# EasyEDA Pro project Project.eprj

# Schematic Schematic
Create Date: 2023-04-05; Page Name: Final; Project Name: Project; Schematic Name: Schematic; Update Date: 2023-04-13; Version: V1.0
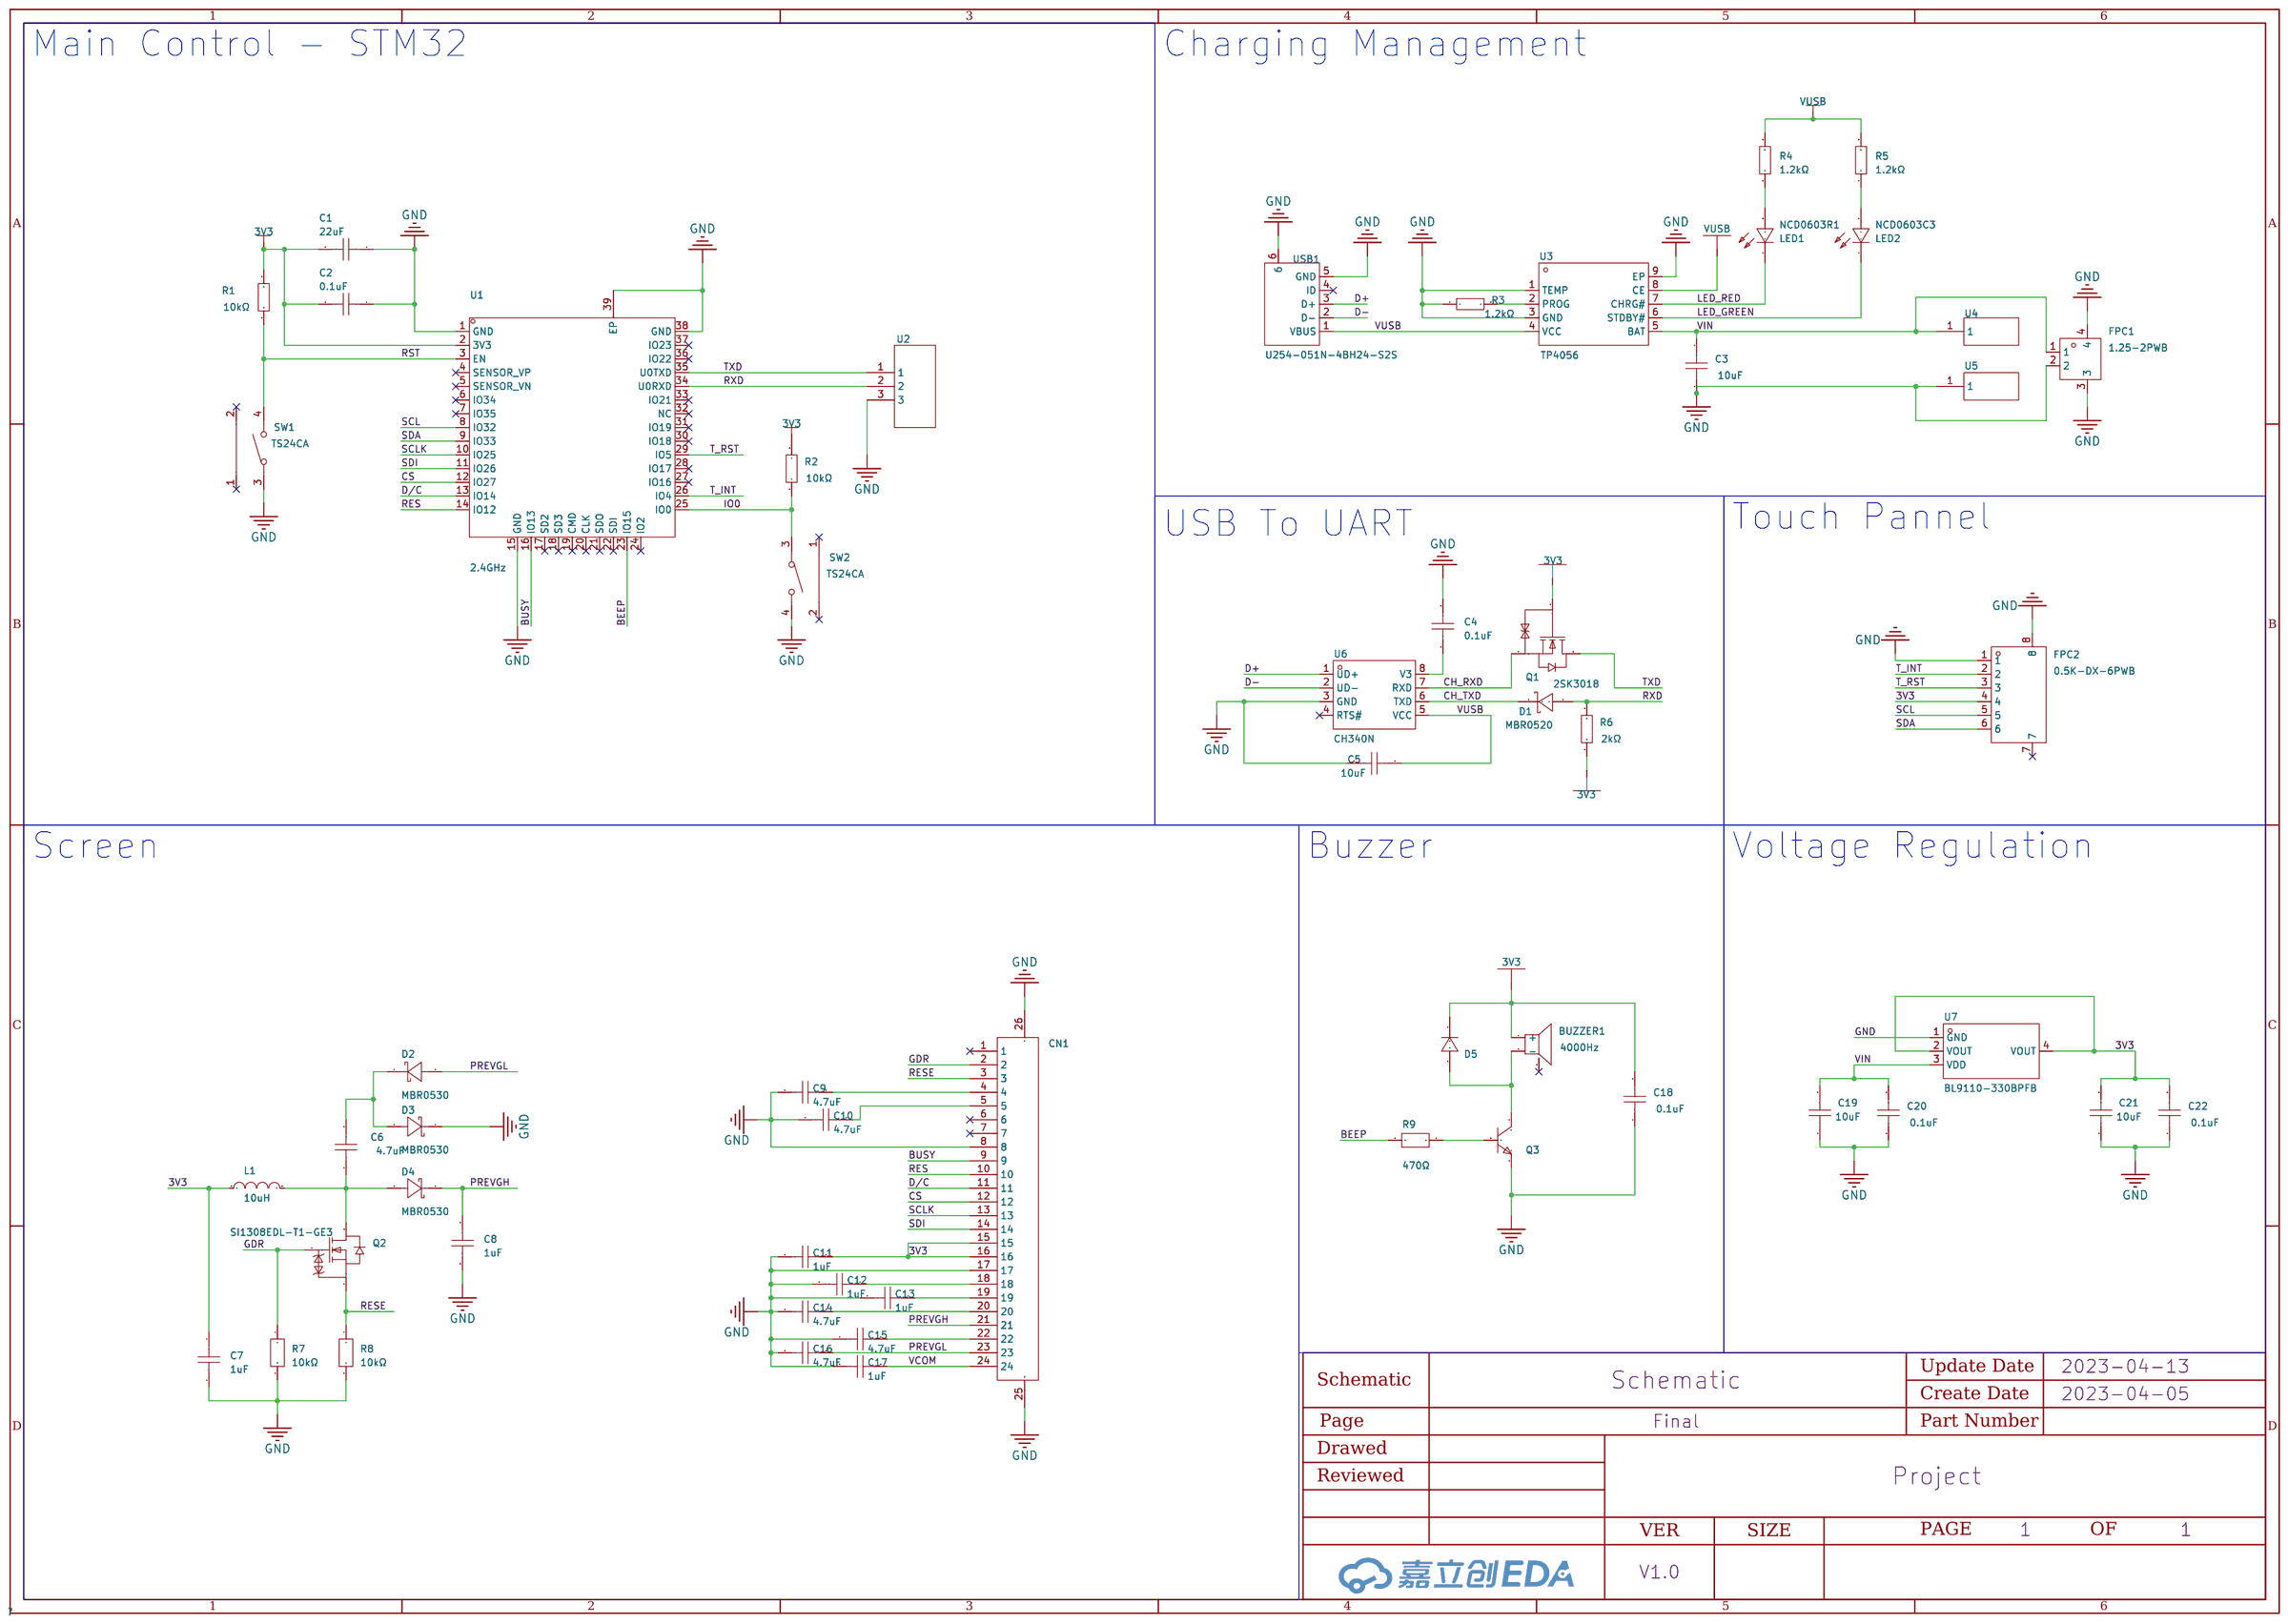
[diagram p0: schematic sheet]

## Parts
BUZZER1  4000Hz  [BUZ-SMD_L5.0-W5.5-P4.60]
C1  22uF  [c0603]
C2  0.1uF  [c0603]
C3  10uF  [C0603]
C4  0.1uF  [C0603]
C5  10uF  [c0603]
C6  4.7uF  [c0603]
C7  1uF  [c0603]
C8  1uF  [c0603]
C9  4.7uF  [C0603]
C10  4.7uF  [C0603]
C11  1uF  [c0603]
C12  1uF  [c0603]
C13  1uF  [c0603]
C14  4.7uF  [C0603]
C15  4.7uF  [C0603]
C16  4.7uF  [C0603]
C17  1uF  [c0603]
C18  0.1uF  [C0603]
C19  10uF  [c0603]
C20  0.1uF  [C0603]
C21  10uF  [c0603]
C22  0.1uF  [C0603]
CN1  0.5-24P翻盖  [FPC-SMD_24P-P0.50-L6.1-W16.4]
D1  MBR0520  [SOD-123_L2.8-W1.8-LS3.7-RD]
D2  MBR0530  [SOD-123_L2.7-W1.6-LS3.7-RD-1]
D3  MBR0530  [SOD-123_L2.7-W1.6-LS3.7-RD-1]
D4  MBR0530  [SOD-123_L2.7-W1.6-LS3.7-RD-1]
D5  IN4148WS  [SOD-323_L1.8-W1.3-LS2.5-RD]
FPC1  1.25-2PWB  [CONN-SMD_2P-P1.25_DEALON_1.25-2PWB]
FPC2  0.5K-DX-6PWB  [FPC-SMD_6P-P0.50_DEALON_0.5K-DX-6PWB]
L1  10uH  [ind-smd_l2.0-w1.6]
LED1  NCD0603R1  [LED0603-RD_RED]
LED2  NCD0603C3  [LED0603-RD]
Q1  2SK3018  [SOT-23-3_L2.9-W1.3-P1.90-LS2.4-BR]
Q2  SI1308EDL-T1-GE3  [SOT-323_L2.0-W1.3-P1.30-LS2.1-BR]
Q3  KST8050S  [SOT-23_L2.9-W1.3-P1.90-LS2.4-BR]
R1  10kΩ  [R0603]
R2  10kΩ  [R0603]
R3  1.2kΩ  [R0603]
R4  1.2kΩ  [R0603]
R5  1.2kΩ  [R0603]
R6  2kΩ  [R0603]
R7  10kΩ  [r0603]
R8  10kΩ  [r0603]
R9  470Ω  [r0603]
SW1  TS24CA  [SW-SMD_TS24CA]
SW2  TS24CA  [SW-SMD_TS24CA]
U1  2.4GHz  [WIRELM-SMD_ESP32-S]
U2  -  [下载调试点]
U3  TP4056  [ESOP-8_L4.9-W3.9-P1.27-LS6.0-BL-EP]
U4  -  [电池焊接端子封装2]
U5  -  [电池焊接端子封装2]
U6  CH340N  [SOP-8_L4.9-W3.9-P1.27-LS6.0-BL]
U7  BL9110-330BPFB  [SOT-223_L6.5-W3.5-P2.30-LS7.0-BR]
USB1  U254-051N-4BH24-S2S  [MICRO-USB-SMD_U254-051N-4BH24-S2]

## Library data of the parts
BUZZER1 = MLT-5020: 驱动方式:无源(外部驱动);构造类型:电磁式;频率:4000Hz;长度:5.2mm;宽度:5.2mm;高度:2.5mm;; Supplier Part: C94598; Manufacturer: 华能; Supplier Footprint: SMD,5x5mm; JLCPCB Part Class: Extended Part; Datasheet: https://atta.szlcsc.com/upload/public/pdf/source/20210811/111454390007D221D7259018FB170E62.pdf; Supplier: LCSC; Oscillator Circuit: 无源(外部驱动); Technology Type: 电磁式; Length: 5.2mm; Width: 5.2mm; Height: 2.5mm
C1 = mt18n1r5c500ct: 容值:22uF;精度:±0.25pF;额定电压:50V;温度系数:NP0;; LCSC Part Name: 22uF 25V; Supplier Part: C96446; Manufacturer: 华新科(Walsin); Manufacturer Part: MT18N1R5C500CT; Supplier Footprint: 0603; JLCPCB Part Class: Extended Part; Datasheet: https://atta.szlcsc.com/upload/public/pdf/source/20191217/C470045_C8EA1FED8E7D9FF06975A0CE3DEB0325.pdf; Supplier: LCSC; Tolerance: ±0.25pF; Voltage Rated: 50V; Temperature Coefficient: NP0
C2 = mt18n1r5c500ct: 容值：100nF 精度：±10% 额定电压：50V 材质(温度系数)：X7R 材质:X7R; LCSC Part Name: 100nF; Supplier Part: C14663; Manufacturer: 华新科(Walsin); Manufacturer Part: MT18N1R5C500CT; Supplier Footprint: 0603; JLCPCB Part Class: Extended Part; Datasheet: https://atta.szlcsc.com/upload/public/pdf/source/20191217/C470045_C8EA1FED8E7D9FF06975A0CE3DEB0325.pdf; Supplier: LCSC; Tolerance: ±0.25pF; Voltage Rated: 50V; Temperature Coefficient: NP0
C3 = JMK107BC6106MA-T: 容值:10uF;精度:±20%;额定电压:-;材质(温度系数):-;; LCSC Part Name: 10uF ±20%; Supplier Part: C669868; Manufacturer: TAIYO YUDEN(太诱); Supplier Footprint: 0603; JLCPCB Part Class: Extended Part; Datasheet: https://atta.szlcsc.com/upload/public/pdf/source/20200708/C669868_7EB6EA763537011BBD5B3495B56B624F.pdf; Supplier: LCSC; Tolerance: ±20%
C4 = CC0603KRX7R9BB104: 温度系数:X7R;容值:100nF;电容体长:-;精度:±10%;电容体宽:-;电容体厚度:-;额定电压:50V;; LCSC Part Name: 100nF ±10% 50V; Supplier Part: C14663; Manufacturer: YAGEO(国巨); Supplier Footprint: 0603; JLCPCB Part Class: Basic Part; Datasheet: https://atta.szlcsc.com/upload/public/pdf/source/20170116/1484561234239.pdf; Supplier: LCSC; Temperature Coefficient: X7R; Tolerance: ±10%; Voltage Rated: 50V
C5 = mt18n1r5c500ct: 容值:10uF;精度:±0.25pF;额定电压:50V;温度系数:NP0;; LCSC Part Name: 10uF 25V; Supplier Part: C96446; Manufacturer: 华新科(Walsin); Manufacturer Part: MT18N1R5C500CT; Supplier Footprint: 0603; JLCPCB Part Class: Extended Part; Datasheet: https://atta.szlcsc.com/upload/public/pdf/source/20191217/C470045_C8EA1FED8E7D9FF06975A0CE3DEB0325.pdf; Supplier: LCSC; Tolerance: ±0.25pF; Voltage Rated: 50V; Temperature Coefficient: NP0
C6 = mt18n1r5c500ct: 容值：4.7uF 精度：±10% 额定电压：35V 材质(温度系数)：X5R; LCSC Part Name: 4.7uF 35V; Supplier Part: C329940; Manufacturer: 华新科(Walsin); Manufacturer Part: MT18N1R5C500CT; Supplier Footprint: 0603; JLCPCB Part Class: Extended Part; Datasheet: https://atta.szlcsc.com/upload/public/pdf/source/20191217/C470045_C8EA1FED8E7D9FF06975A0CE3DEB0325.pdf; Supplier: LCSC; Tolerance: ±0.25pF; Voltage Rated: 50V; Temperature Coefficient: NP0
C7 C8 C11-C13 C17 = mt18n1r5c500ct: 容值：1uF 精度：±10% 额定电压：50V 材质(温度系数)：X5R 材质:X5R; LCSC Part Name: 1uF 50V; Supplier Part: C15849; Manufacturer: 华新科(Walsin); Manufacturer Part: MT18N1R5C500CT; Supplier Footprint: 0603; JLCPCB Part Class: Extended Part; Datasheet: https://atta.szlcsc.com/upload/public/pdf/source/20191217/C470045_C8EA1FED8E7D9FF06975A0CE3DEB0325.pdf; Supplier: LCSC; Tolerance: ±0.25pF; Voltage Rated: 50V; Temperature Coefficient: NP0
C9 C10 C14-C16 = C1608X5R1V475KT000E: 容值:4.7uF;精度:±10%;额定电压:35V;材质(温度系数):X5R;; LCSC Part Name: 4.7uF ±10% 35V; Supplier Part: C329940; Manufacturer: TDK; Supplier Footprint: 0603; JLCPCB Part Class: Extended Part; Datasheet: https://atta.szlcsc.com/upload/public/pdf/source/20190926/C329940_3676AC3B1F2ADAB27683D7ACF547C42E.pdf; Supplier: LCSC; Tolerance: ±10%; Voltage Rated: 35V; Temperature Coefficient: X5R
C18 C20 C22 = CL10B104KB8NNNC: 容值:100nF;精度:±10%;额定电压:50V;温度系数:X7R;; LCSC Part Name: 100nF ±10% 50V; Supplier Part: C1591; Manufacturer: SAMSUNG(三星); Supplier Footprint: 0603; JLCPCB Part Class: Extended Part; Datasheet: https://atta.szlcsc.com/upload/public/pdf/source/20160103/1457707680512.pdf; Supplier: LCSC; Tolerance: ±10%; Voltage Rated: 50V; Temperature Coefficient: X7R
C19 C21 = mt18n1r5c500ct: 容值:10uF;精度:±0.25pF;额定电压:50V;温度系数:NP0;; Supplier Part: C96446; Manufacturer: 华新科(Walsin); Manufacturer Part: MT18N1R5C500CT; Supplier Footprint: 0603; JLCPCB Part Class: Extended Part; Datasheet: https://atta.szlcsc.com/upload/public/pdf/source/20191217/C470045_C8EA1FED8E7D9FF06975A0CE3DEB0325.pdf; Supplier: LCSC; Tolerance: ±0.25pF; Voltage Rated: 50V; Temperature Coefficient: NP0
CN1 = 0.5-24P翻盖: 间距:0.5mm;触点数量:24;锁定特性:翻盖式;安装类型:卧贴;触点类型:下接;工作温度范围:-;; LCSC Part Name: 0.5mm P数:24 翻盖式 下接; Supplier Part: C20688; Manufacturer: BOOMELE(博穆精密); Supplier Footprint: SMD,P=0.5mm; JLCPCB Part Class: Extended Part; Datasheet: https://atta.szlcsc.com/upload/public/pdf/source/20151109/1457707553990.pdf; Supplier: LCSC; Pitch: 0.5mm; Number of Contacts: 24; Locking Feature: 翻盖式; Mounting Type: 卧贴; Contact Type: 下接; Height Above Board: 2mm; FFC, FCB Thickness: 0.3mm
D1 = MBR0520_C77335: 直流反向耐压(Vr):20V;平均整流电流(Io):500mA;正向压降(Vf):450mV 500mA;; Supplier Part: C77335; Manufacturer: CJ（江苏长电/长晶）; Supplier Footprint: SOD-123; JLCPCB Part Class: Extended Part; Datasheet: https://atta.szlcsc.com/upload/public/pdf/source/20160702/1467448303289.pdf; Supplier: LCSC; Reverse Voltage (Vr): 20V; Average Rectified Current (Io): 500mA; Forward Voltage (Vf@If): 450mV 500mA
D2-D4 = MBR0530_C699108: LCSC Part Name: 小信号肖特基二极管; Supplier Part: C699108; Manufacturer: YANGJIE(扬杰); Supplier Footprint: SOD-123; JLCPCB Part Class: Extended Part; Datasheet: https://atta.szlcsc.com/upload/public/pdf/source/20200709/C699108_94C8F1A54679DD603C9696C8694A3BC2.pdf; Supplier: LCSC
D5 = IN4148WS: 二极管配置:独立式;功率:200mW;直流反向耐压(Vr):100V;平均整流电流(Io):200mA;正向压降(Vf):1V@10mA;反向电流(Ir):5A@75V;反向恢复时间(trr):4ns;工作温度:+150@(Tj);; LCSC Part Name: 100V 200mA 4ns; Supplier Part: C417545; Manufacturer: LRC(乐山无线电); Supplier Footprint: SOD-323; JLCPCB Part Class: 扩展库; Datasheet: https://atta.szlcsc.com/upload/public/pdf/source/20190911/C417545_CB999573A39316D3E44B0FF1B4B78E30.pdf; Supplier: LCSC; Diode Configuration: 独立式; Power Dissipation: 200mW; Reverse Voltage (Vr): 100V; Average Rectified Current (Io): 200mA; Forward Voltage (Vf@If): 1V@10mA; Reverse Leakage Current: 5A@75V; Reverse Recovery Time (trr): 4ns; Operating Temperature: +150@(Tj)
FPC1 = 1.25-2PWB: 参考系列:-;间距:1.25mm;插针结构:1x2P;排数:1;每排PIN数:2;行距:-;公母:公型插针;安装方式:卧贴;额定电流:-;工作温度范围:-40~+85;; LCSC Part Name: 1.25mm 1x2P 卧贴; Supplier Part: C2905009; Manufacturer: DEALON(德艺隆); Supplier Footprint: SMD,P=1.25mm; JLCPCB Part Class: 扩展库; Datasheet: https://atta.szlcsc.com/upload/public/pdf/source/20211025/32B11FCE5054D08D2841E43E3DE676AA.pdf; Supplier: LCSC; Pitch: 1.25mm; Pins Structure: 1x2P; Number of Rows: 1; Number of PINs Per Row: 2; Gender: 公型插针; Mounting Style: 卧贴; Operating Temperature Range: -40~+85
FPC2 = 0.5K-DX-6PWB: 间距:0.5mm;触点数量:6;锁定特性:翻盖式;安装类型:卧贴;触点类型:下接;工作温度范围:-20℃~+85℃;; LCSC Part Name: 0.5mm P数:6 翻盖式 下接; Supplier Part: C2911832; Manufacturer: HDGC(华德共创); Supplier Footprint: SMD,P=0.5mm; JLCPCB Part Class: Extended Part; Datasheet: https://atta.szlcsc.com/upload/public/pdf/source/20211029/5210AEC837E1AC9B697C39805C1E664F.pdf; Supplier: LCSC; Pitch: 0.5mm; Number of Contacts: 6; Locking Feature: 翻盖式; Mounting Type: 卧贴; Contact Type: 下接; Height Above Board: 2mm; FFC, FCB Thickness: 0.3mm; Operating Temperature Range: -20℃~+85℃
L1 = wpn201610h100mt: 电感值:10uH;精度:±20%;额定电流:650mA;直流电阻(DCR):826mΩ;; LCSC Part Name: 10uH ±20% 650mA 826mΩ; Supplier Part: C89132; Manufacturer: Sunlord(顺络); Manufacturer Part: WPN201610H100MT; Supplier Footprint: SMD; JLCPCB Part Class: Extended Part; Datasheet: https://atta.szlcsc.com/upload/public/pdf/source/20210916/5D33DED32780FEB7D0AA8BED8FC93477.pdf; Supplier: LCSC; Tolerance: ±20%; Rated Current: 650mA; DC Resistance (DCR): 826mΩ
LED1 = NCD0603R1_C84263: 发光颜色:红灯;; LCSC Part Name: 红灯; Supplier Part: C84263; Manufacturer: 国星光电; Supplier Footprint: 0603; JLCPCB Part Class: Extended Part; Datasheet: https://atta.szlcsc.com/upload/public/pdf/source/20200820/C84263_DABC6A75E58F576973B407FDBA283D60.pdf; Supplier: LCSC; Emitted Color: 红灯
LED2 = NCD0603C3: 发光颜色:普绿/黄绿;; LCSC Part Name: 普绿/黄绿; Supplier Part: C89809; Manufacturer: 国星光电; Supplier Footprint: 0603; JLCPCB Part Class: Extended Part; Datasheet: https://atta.szlcsc.com/upload/public/pdf/source/20200820/C89809_21AF9C24539E838255C9E61C110C9630.pdf; Supplier: LCSC; Emitted Color: 普绿/黄绿
Q1 = 2SK3018_C8562: 阈值电压(Vgs(th)@Id):1.5V 100A;功率(Pd):350mW;导通电阻(RDS(on)@Vgs,Id):8Ω 10mA,4V;漏源电压(Vdss):30V;类型:N沟道;连续漏极电流(Id):100mA;; Supplier Part: C8562; Manufacturer: CJ（江苏长电/长晶）; Supplier Footprint: SOT-23(SOT-23-3); JLCPCB Part Class: Extended Part; Datasheet: https://atta.szlcsc.com/upload/public/pdf/source/20140809/1457707215233.pdf; Supplier: LCSC; Gate Threshold Voltage (Vgs(th)@Id): 1.5V 100A; Power Dissipation (Pd): 350mW; Drain Source On Resistance (RDS(on)@Vgs,Id): 8Ω 10mA,4V; Drain Source Voltage (Vdss): 30V; Type: N沟道; Continuous Drain Current (Id): 100mA
Q2 = SI1308EDL-T1-GE3: 连续漏极电流(Id):1.4A;漏源电压(Vdss):30V;类型:N沟道;阈值电压(Vgs(th)@Id):1.5V 250A;导通电阻(RDS(on)@Vgs,Id):132mΩ 1.4A,10V;功率(Pd):400mW;; Supplier Part: C469327; Manufacturer: VISHAY(威世); Supplier Footprint: SOT-323; JLCPCB Part Class: Extended Part; Datasheet: https://atta.szlcsc.com/upload/public/pdf/source/20191217/C469327_3FE8BCBB7604A1B1F6779A1D9DD725BB.pdf; Supplier: LCSC; Continuous Drain Current (Id): 1.4A; Drain Source Voltage (Vdss): 30V; Type: N沟道; Gate Threshold Voltage (Vgs(th)@Id): 1.5V 250A; Drain Source On Resistance (RDS(on)@Vgs,Id): 132mΩ 1.4A,10V; Power Dissipation (Pd): 400mW
Q3 = KST8050S: 晶体管类型:NPN;集射极击穿电压(Vceo):25V;集电极电流(Ic):500mA;功率(Pd):300mW;; Supplier Part: C369924; Manufacturer: KEXIN(科信); Supplier Footprint: SOT-23; JLCPCB Part Class: 扩展库; Datasheet: https://atta.szlcsc.com/upload/public/pdf/source/20190320/C369924_F8D3618043520638745BFFFB8460FA42.pdf; Supplier: LCSC; Transistor Type: NPN; Collector-Emitter Breakdown Voltage (Vceo): 25V; Collector Current (Ic): 500mA; Power Dissipation (Pd): 300mW
R1 R2 = ERJPB3B1002V: 电阻类型:厚膜电阻;阻值:10kΩ;精度:±0.1%;功率:200mW;温度系数:±50ppm/℃;最大工作电压:200V;工作温度范围:-55℃~+155℃;; LCSC Part Name: 10kΩ ±0.1% 200mW; Supplier Part: C161787; Manufacturer: PANASONIC(松下); Supplier Footprint: 0603; Datasheet: https://atta.szlcsc.com/upload/public/pdf/source/20180125/C161787_15168649453061302830.pdf; Supplier: LCSC; Type: 厚膜电阻; Tolerance: ±0.1%; Power(Watts): 200mW; Temperature Coefficient: ±50ppm/℃; Overload Voltage (Max): 200V; Operating Temperature Range: -55℃~+155℃
R3-R5 = MCR03EZPJ122: 电阻类型:厚膜电阻;阻值:1.2kΩ;精度:±5%;功率:100mW;温度系数:±200ppm/℃;最大工作电压:50V;工作温度范围:-55℃~+155℃;; LCSC Part Name: 1.2kΩ ±5% 100mW; Supplier Part: C162003; Manufacturer: ROHM(罗姆); Supplier Footprint: 0603; JLCPCB Part Class: Extended Part; Datasheet: https://atta.szlcsc.com/upload/public/pdf/source/20180719/C162003_059215F5F2DABBD5624ED248BA884FE5.pdf; Supplier: LCSC; Type: 厚膜电阻; Tolerance: ±5%; Power(Watts): 100mW; Temperature Coefficient: ±200ppm/℃; Overload Voltage (Max): 50V; Operating Temperature Range: -55℃~+155℃
R6 = 0603WAF2001T5E: 精度:±1%;阻值:2kΩ;温度系数:±100ppm/℃;功率:1/10W;最大工作电压:75V;工作温度范围:-55℃~+155℃;; LCSC Part Name: 2KΩ ±1%; Supplier Part: C22975; Manufacturer: UNI-ROYAL(厚声); Supplier Footprint: 0603; JLCPCB Part Class: Basic Part; Datasheet: https://atta.szlcsc.com/upload/public/pdf/source/20170920/C22975_1505901012894982362.pdf; Supplier: LCSC; Tolerance: ±1%; Temperature Coefficient: ±100ppm/℃; Power(Watts): 1/10W; Overload Voltage (Max): 75V; Operating Temperature Range: -55℃~+155℃
R7 R8 = sg73p1jttd1002f: 阻值:10kΩ;精度:±1%;功率:-;温度系数:-;; LCSC Part Name: 10kΩ ±1%; Supplier Part: C880254; Manufacturer: KOA; Manufacturer Part: SG73P1JTTD1002F; Supplier Footprint: 0603; JLCPCB Part Class: Extended Part; Datasheet: https://atta.szlcsc.com/upload/public/pdf/source/20190109/C346159_A2BB9C83E7E727C8F8277542505B206B.pdf; Supplier: LCSC; Tolerance: ±1%
R9 = sg73p1jttd1002f: 阻值:470Ω;精度:±1%;功率:-;温度系数:-;; LCSC Part Name: 470kΩ ±1%; Supplier Part: C23179; Manufacturer: KOA; Manufacturer Part: SG73P1JTTD1002F; Supplier Footprint: 0603; JLCPCB Part Class: Extended Part; Datasheet: https://atta.szlcsc.com/upload/public/pdf/source/20190109/C346159_A2BB9C83E7E727C8F8277542505B206B.pdf; Supplier: LCSC; Tolerance: ±1%
SW1 SW2 = TS24CA: 触点电流:50mA;额定电压(DC):12V;电路结构:单刀单掷;安装方式:卧贴;按钮形状:矩形按钮;带灯:-;开关长度:4.55mm;开关宽度:1.8mm;开关高度:3.5mm;; LCSC Part Name: 2*4*3.5半包小贝贝TS-018小侧按键m165蓝牙耳机轻触开关; Supplier Part: C393942; Manufacturer: SHOU HAN(首韩); Supplier Footprint: SMD; JLCPCB Part Class: Extended Part; Datasheet: https://atta.szlcsc.com/upload/public/pdf/source/20190521/C393942_591A9E318887EFA4274D34029981AD99.pdf; Supplier: LCSC; Contact Current: 50mA; Voltage Rating (DC): 12V; Circuit: 单刀单掷; Mounting Style: 卧贴; Actuator Style: 矩形按钮; Switch Length: 4.55mm; Switch Width: 1.8mm; Switch Height: 3.5mm
U1 = ESP32-S: 频率:2.4GHz;发射功率:17dBm;核心处理器:LX6;天线形式:板载 PCB 天线/外接 IPEX;接收灵敏度:-90dBm;; Supplier Part: C277944; Manufacturer: Ai-Thinker(安信可); Supplier Footprint: SMD; JLCPCB Part Class: Extended Part; Datasheet: https://atta.szlcsc.com/upload/public/pdf/source/20211217/F4BEA33E732D6002D10DAED85BBCB52B.pdf; Supplier: LCSC; Output Power: 17dBm; Core Processor: LX6; Support Interface: I2C；UART；DAC；SPI；PWM；ADC; Antenna Type: 板载 PCB 天线/外接 IPEX; Wireless Standard: 802.11b/g/n; Operating Voltage: 3.3V; Sensitivity: -90dBm; Operating Temperature: -40℃~+85℃
U2 = 下载调试点
U3 = TP4056_C382139: LCSC Part Name: 1A锂电池充电IC; Supplier Part: C382139; Manufacturer: TPOWER(天源); Supplier Footprint: ESOP-8; JLCPCB Part Class: Extended Part; Datasheet: https://atta.szlcsc.com/upload/public/pdf/source/20190327/C382139_EC85960E6FE3E26856C240C81751A184.pdf; Supplier: LCSC
U4 U5 = 电池焊接端子2
U6 = CH340N: Supplier Part: C2977777; Manufacturer: WCH(南京沁恒); Supplier Footprint: SOP-8; JLCPCB Part Class: Extended Part; Datasheet: https://atta.szlcsc.com/upload/public/pdf/source/20220223/82A45E4FF89B3EDCAD50B354450A7EF4.pdf; Supplier: LCSC
U7 = BL9110-330BPFB: 输出类型:固定;输出极性:正;输出通道数:1;最大输入电压:6V;输出电压:3.3V;压差:390mV@(1A);输出电流:1A;电源纹波抑制比(PRSS):70dB@(1kHz);; LCSC Part Name: Vin=6V Vout=3.3V 1A 70dB@(1kHz); Supplier Part: C169246; Manufacturer: BL(上海贝岭); Supplier Footprint: SOT-223; JLCPCB Part Class: 扩展库; Datasheet: https://atta.szlcsc.com/upload/public/pdf/source/20180104/C169246_15150688220401230505.pdf; Supplier: LCSC; Output Type: 固定; Output Polarity: 正; Number of Outputs: 1; Maximum Input Voltage: 6V; Output Voltage: 3.3V; Dropout Voltage: 390mV@(1A); Output Current: 1A; Power Supply Rejection Ratio (PRSS): 70dB@(1kHz)
USB1 = U254-051N-4BH24-S2S: 连接器类型:Micro-B;标准:USB 2.0;公母:母座;触点数量:5;端口数量:1;安装方式:卧贴;额定电流 - 电源:1.8A;触头材质:铜合金;触头镀层:金;工作温度范围:-40℃~+85℃;焊接温度(最大值):260℃;; LCSC Part Name: Micro-B 母座 卧贴; Supplier Part: C692421; Manufacturer: XKB Connectivity(中国星坤); Supplier Footprint: SMD; JLCPCB Part Class: Extended Part; Datasheet: https://atta.szlcsc.com/upload/public/pdf/source/20211011/B206D16459F712703796869A87C6FBF1.pdf; Supplier: LCSC; Connector Type: Micro-B; Standard: USB 2.0; Gender: 母座; Number of Contacts: 5; Number of Ports: 1; Mounting Style: 卧贴; Current Rating - Power (Max): 1.8A; Contact Material: 铜合金; Contact Plating: 金; Operating Temperature Range: -40℃~+85℃; Welding Temperature (Max): 260℃

## Nets
3V3: BUZZER1.1(+) C1.2 C2.2 C7.1 C11.1 C18.2 C21.2 C22.2 CN1.15 CN1.16 D5.1(C) FPC2.4 L1.1 Q1.1(G) R1.2 R2.2 R6.1 U1.2(3V3) U7.2(VOUT) U7.4(VOUT)
GND: C1.1 C2.1 C3.1 C4.2 C5.2 C7.2 C8.2 C9.1 C10.1 C11.2 C12.2 C13.2 C14.1 C15.1 C16.1 C17.2 C18.1 C19.1 C20.1 C21.1 C22.1 CN1.8 CN1.17 CN1.25 CN1.26 D3.1(K) FPC1.2 FPC1.3 FPC1.4 FPC2.1 FPC2.8 Q3.2(E) R3.1 R7.2 R8.2 SW1.3 SW2.4 U1.1(GND) U1.15(GND) U1.38(GND) U1.39(EP) U2.3 U3.1(TEMP) U3.3(GND) U3.9(EP) U5.1 U6.3(GND) U7.1(GND) USB1.5(GND) USB1.6
VIN: C3.2 C19.2 C20.2 FPC1.1 U3.5(BAT) U4.1 U7.3(VDD)
BEEP: R9.1 U1.23(IO15)
BUSY: CN1.9 U1.16(IO13)
CH_RXD: Q1.2(S) U6.7(RXD)
CH_TXD: D1.1(K) U6.6(TXD)
CS: CN1.12 U1.12(IO27)
D+: U6.1(UD+) USB1.3(D+)
D-: U6.2(UD-) USB1.2(D-)
D/C: CN1.11 U1.13(IO14)
GDR: CN1.2 Q2.1(G) R7.1
IO0: R2.1 SW2.3 U1.25(IO0)
LED_GREEN: LED2.1(K) U3.6(STDBY#)
LED_RED: LED1.1(K) U3.7(CHRG#)
PREVGH: C8.1 CN1.21 D4.1(K)
PREVGL: C16.2 CN1.23 D2.2(A)
RES: CN1.10 U1.14(IO12)
RESE: CN1.3 Q2.2(S) R8.1
RST: R1.1 SW1.4 U1.3(EN)
RXD: D1.2(A) R6.2 U1.34(U0RXD) U2.2
SCL: FPC2.5 U1.8(IO32)
SCLK: CN1.13 U1.10(IO25)
SDA: FPC2.6 U1.9(IO33)
SDI: CN1.14 U1.11(IO26)
T_INT: FPC2.2 U1.26(IO4)
T_RST: FPC2.3 U1.29(IO5)
TXD: Q1.3(D) U1.35(U0TXD) U2.1
VCOM: C17.1 CN1.24
VUSB: C5.1 R4.2 R5.2 U3.4(VCC) U3.8(CE) U6.5(VCC) USB1.1(VBUS)
$15N651: LED2.2(A) R5.1
$15N655: R3.2 U3.2(PROG)
$15N663: LED1.2(A) R4.1
$15N3080: C4.1 U6.8(V3)
$15N5648: C6.1 D4.2(A) L1.2 Q2.3(D)
$15N5649: C6.2 D2.1(K) D3.2(A)
$15N5898: BUZZER1.2(-) D5.2(A) Q3.3(C)
$15N5899: Q3.1(B) R9.2
Net-(C9-2): C9.2 CN1.4
Net-(C10-2): C10.2 CN1.5
Net-(C12-1): C12.1 CN1.18
Net-(C13-1): C13.1 CN1.19
Net-(C14-2): C14.2 CN1.20
Net-(C15-2): C15.2 CN1.22

Not connected (* = marked no-connect by the designer): BUZZER1 3(NC)*; CN1 1* 6* 7*; FPC2 7*; SW1 1* 2*; SW2 1* 2*; U1 4(SENSOR_VP)* 5(SENSOR_VN)* 6(IO34)* 7(IO35)* 17(SD2)* 18(SD3)* 19(CMD)* 20(CLK)* 21(SDO)* 22(SDI)* 24(IO2)* 27(IO16)* 28(IO17)* 30(IO18)* 31(IO19)* 32(NC)* 33(IO21)* 36(IO22)* 37(IO23)*; U6 4(RTS#)*; USB1 4(ID)*

## Notes on the sheet
- Main Control - STM32
- Charging Management
- Touch Pannel
- USB To UART
- Screen
- Buzzer
- Voltage Regulation

# Board PCB
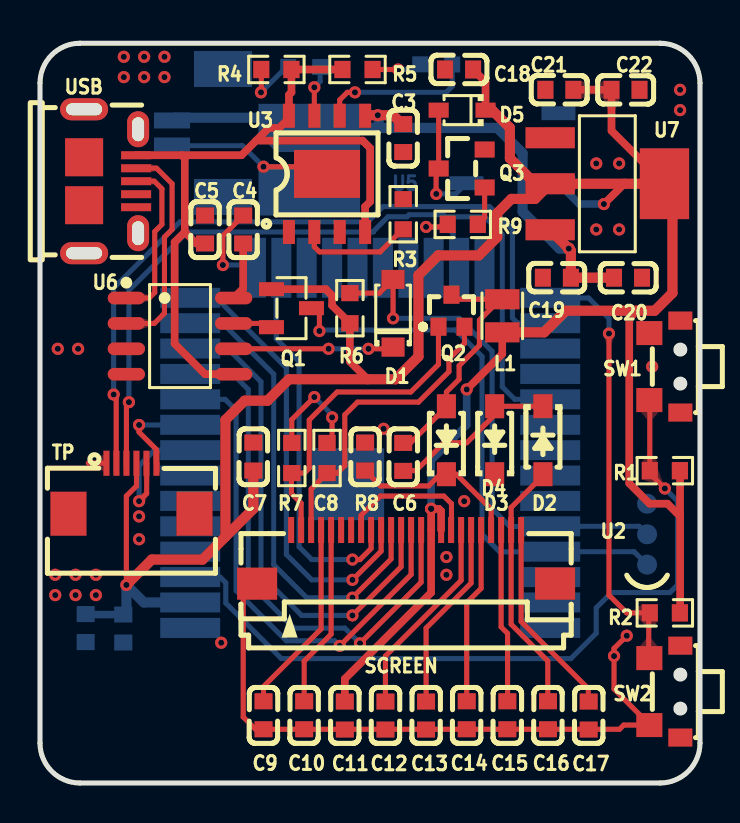
[diagram p1: board, top side]
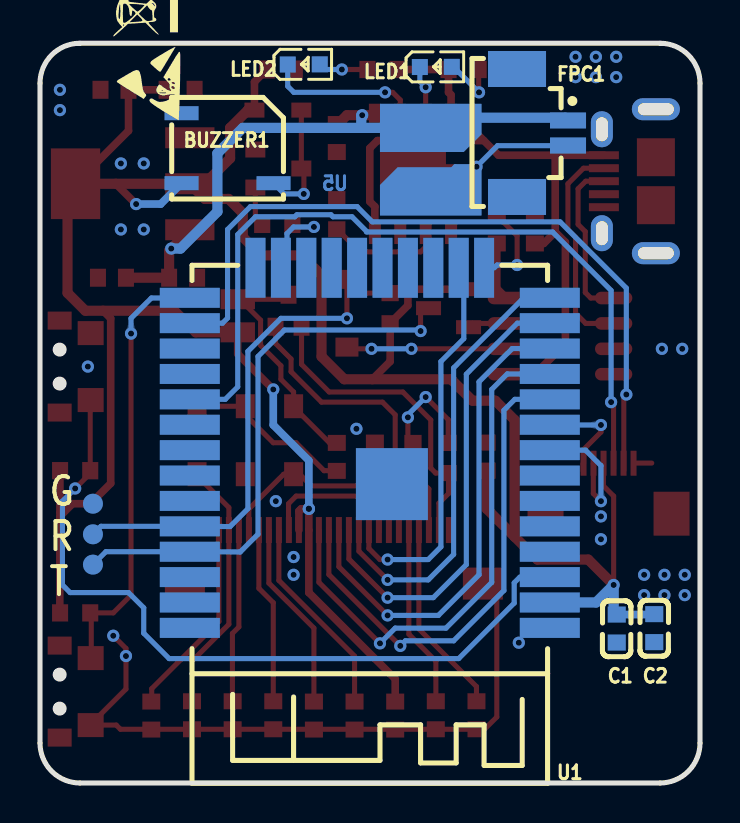
[diagram p2: board, bottom side, seen from below]

Outline 33 x 37 mm; copper layers: Top Layer, Bottom Layer. Coordinates in mm from the lower left corner of the outline.
Outline path: 0,35 0,2 arc(0.59,0.59) 2,0 31,0 arc(32.41,0.59) 33,2 33,35 arc(32.41,36.41) 31,37 2,37 arc(0.59,36.41) 0,35
Stack: Top Layer 0.035mm / Dielectric1 1.51mm FR4 er 4.5 / Bottom Layer 0.035mm

## Design rules (mm)
spacing safeClearance (default): track to track 0.152, other pairs 0.152 to 0.3
track width trackWidth (default): min 0.127, default 0.254, max 2.54
differential pair differentialPair (default): width min 0.127, default 0.254, max 2.54; gap min 0.152, default 0.152
via viaSize (default): diameter min 0.5, default 0.61, max 10; hole min 0.3, default 0.305, max 6

## Placement (name value [footprint] x y rotation side)
BUZZER1  4000Hz  [BUZ-SMD_L5.0-W5.5-P4.60]  23.62 31.75 180 bottom
C1  22uF  [c0603]  4.16 7.73 90 bottom
C2  0.1uF  [c0603]  2.29 7.75 90 bottom
C3  10uF  [C0603]  18.16 32.26 90 top
C4  0.1uF  [C0603]  10.16 27.69 90 top
C5  10uF  [c0603]  8.25 27.69 90 top
C6  4.7uF  [c0603]  18.16 16.31 270 top
C7  1uF  [c0603]  10.67 16.33 90 top
C8  1uF  [c0603]  16.26 16.33 90 top
C9  4.7uF  [C0603]  11.18 3.39 90 top
C10  4.7uF  [C0603]  13.21 3.39 90 top
C11  1uF  [c0603]  15.24 3.37 270 top
C12  1uF  [c0603]  17.27 3.37 270 top
C13  1uF  [c0603]  19.3 3.37 270 top
C14  4.7uF  [C0603]  21.34 3.39 90 top
C15  4.7uF  [C0603]  23.37 3.39 90 top
C16  4.7uF  [C0603]  25.4 3.39 90 top
C17  1uF  [c0603]  27.43 3.37 270 top
C18  0.1uF  [C0603]  20.96 35.69 0 top
C19  10uF  [c0603]  25.84 25.27 0 top
C20  0.1uF  [C0603]  29.4 25.27 180 top
C21  10uF  [c0603]  25.97 34.67 0 top
C22  0.1uF  [C0603]  29.28 34.67 180 top
D1  MBR0520  [SOD-123_L2.8-W1.8-LS3.7-RD]  17.65 23.5 90 top
D2  MBR0530  [SOD-123_L2.7-W1.6-LS3.7-RD-1]  25.15 17.14 270 top
D3  MBR0530  [SOD-123_L2.7-W1.6-LS3.7-RD-1]  22.73 17.14 90 top
D4  MBR0530  [SOD-123_L2.7-W1.6-LS3.7-RD-1]  20.32 17.14 90 top
D5  IN4148WS  [SOD-323_L1.8-W1.3-LS2.5-RD]  21.1 33.66 180 top
FPC1  1.25-2PWB  [CONN-SMD_2P-P1.25_DEALON_1.25-2PWB]  7.87 32.51 270 bottom
L1  10uH  [ind-smd_l2.0-w1.6]  23.11 23.37 270 top
LED1  NCD0603R1  [LED0603-RD_RED]  13.21 35.81 180 bottom
LED2  NCD0603C3  [LED0603-RD]  19.81 35.94 180 bottom
Q1  2SK3018  [SOT-23-3_L2.9-W1.3-P1.90-LS2.4-BR]  12.57 23.75 180 top
Q2  SI1308EDL-T1-GE3  [SOT-323_L2.0-W1.3-P1.30-LS2.1-BR]  20.57 23.62 270 top
Q3  KST8050S  [SOT-23_L2.9-W1.3-P1.90-LS2.4-BR]  21.08 30.73 0 top
R1  10kΩ  [R0603]  31.24 15.62 0 top
R2  10kΩ  [R0603]  31.24 8.51 0 top
R3  1.2kΩ  [R0603]  18.16 28.45 270 top
R4  1.2kΩ  [R0603]  11.82 35.69 0 top
R5  1.2kΩ  [R0603]  15.88 35.69 180 top
R6  2kΩ  [R0603]  15.49 23.75 90 top
R7  10kΩ  [r0603]  12.59 16.26 90 top
R8  10kΩ  [r0603]  14.35 16.26 90 top
R9  470Ω  [r0603]  21.14 27.94 0 top
SCREEN  0.5-24P翻盖  [FPC-SMD_24P-P0.50-L6.1-W16.4]  18.31 11.31 0 top
SW1  TS24CA  [SW-SMD_TS24CA]  31.24 20.83 270 top
SW2  TS24CA  [SW-SMD_TS24CA]  31.24 4.57 270 top
TP  0.5K-DX-6PWB  [FPC-SMD_6P-P0.50_DEALON_0.5K-DX-6PWB]  4.57 14.73 0 top
U1  2.4GHz  [WIRELM-SMD_ESP32-S]  16.51 16.76 0 bottom
U2  -  [下载调试点]  30.35 11.43 180 top
U3  TP4056  [ESOP-8_L4.9-W3.9-P1.27-LS6.0-BL-EP]  14.35 30.47 0 top
U4  -  [电池焊接端子封装2]  10.92 30.29 0 top
U5  -  [电池焊接端子封装2]  16 32.07 180 top
U6  CH340N  [SOP-8_L4.9-W3.9-P1.27-LS6.0-BL]  7 22.35 270 top
U7  BL9110-330BPFB  [SOT-223_L6.5-W3.5-P2.30-LS7.0-BR]  28.37 29.97 180 top
USB  U254-051N-4BH24-S2S  [MICRO-USB-SMD_U254-051N-4BH24-S2]  3.56 30.1 270 top

## Footprints (pads in the part's own frame, mm; a bottom-side part is the same pattern mirrored in y, then rotated)
BUZ-SMD_L5.0-W5.5-P4.60
  rect 1.7x0.7 smd: 1(-2.3,-1.75) 2(2.3,-1.75) 3(-2.3,1.75)
c0603
  rect 0.8x0.9 smd: 1(-0.7,0) 2(0.7,0)
C0603
  rect 0.8x0.9 smd: 1(-0.7,0) 2(0.7,0)
CONN-SMD_2P-P1.25_DEALON_1.25-2PWB
  rect 0.8x1.801 smd: 1(-0.625,1.275) 2(0.625,1.275)
  rect 1.801x2.901 smd: 3(-3.2,-1.275) 4(3.2,-1.275)
ESOP-8_L4.9-W3.9-P1.27-LS6.0-BL-EP
  rect 0.6x1.2 smd: 1(-1.905,-2.909) 2(-0.635,-2.909) 3(0.635,-2.909) 4(1.905,-2.909) 5(1.905,2.909) 6(0.635,2.909) 7(-0.635,2.909) 8(-1.905,2.909)
  rect 3.3x2.4 smd: 9(0,0)
FPC-SMD_6P-P0.50_DEALON_0.5K-DX-6PWB
  rect 0.3x1.25 smd: 1(-1.25,1.262) 2(-0.75,1.262) 3(-0.25,1.262) 4(0.25,1.262) 5(0.75,1.262) 6(1.25,1.262)
  rect 1.8x2.2 smd: 7(3.15,-1.262) 8(-3.15,-1.262)
FPC-SMD_24P-P0.50-L6.1-W16.4
  rect 0.3x1.3 smd: 1(-5.75,1.34) 2(-5.25,1.34) 3(-4.75,1.34) 4(-4.25,1.34) 5(-3.75,1.34) 6(-3.25,1.34) 7(-2.75,1.34) 8(-2.25,1.34) 9(-1.75,1.34) 10(-1.25,1.34) 11(-0.75,1.34) 12(-0.25,1.34) 13(0.25,1.34) 14(0.75,1.34) 15(1.25,1.34) 16(1.75,1.34) 17(2.25,1.34) 18(2.75,1.34) 19(3.25,1.34) 20(3.75,1.34) 21(4.25,1.34) 22(4.75,1.34) 23(5.25,1.34) 24(5.75,1.34)
  rect 2x1.6 smd: 25(7.449,-1.34) 26(-7.449,-1.34)
ind-smd_l2.0-w1.6
  rect 1x1.72 smd: 1(0.828,0) 2(-0.828,0)
LED0603-RD
  rect 0.8x0.8 smd: 1(-0.799,-0.004) 2(0.799,0.004)
LED0603-RD_RED
  rect 0.8x0.8 smd: 1(-0.799,-0.004) 2(0.799,0.004)
MICRO-USB-SMD_U254-051N-4BH24-S2
  rect 0.4x1.5 smd: 1(-1.3,1.25) 2(-0.65,1.25) 3(0,1.25) 4(0.65,1.25) 5(1.3,1.25)
  oval 1.1x2.4 hole 0.6x1.8: 6(-3.6,-1.35) 6(3.6,-1.35)
  oval 1.8x1.1 hole 1.2x0.6: 6(-2.6,1.35) 6(2.6,1.35)
  rect 1.9x1.9 smd: 6(-1.2,-1.35) 6(1.2,-1.35)
R0603
  rect 0.806x0.864 smd: 1(-0.753,0) 2(0.753,0)
r0603
  rect 0.806x0.864 smd: 1(-0.753,0) 2(0.753,0)
SOD-123_L2.7-W1.6-LS3.7-RD-1
  rect 1.2x0.95 smd: 1(-1.7,0) 2(1.7,0)
SOD-123_L2.8-W1.8-LS3.7-RD
  rect 0.95x1.15 smd: 1(-1.692,0) 2(1.692,0)
SOD-323_L1.8-W1.3-LS2.5-RD
  rect 1x0.75 smd: 1(-1.173,0) 2(1.173,0)
SOP-8_L4.9-W3.9-P1.27-LS6.0-BL
  oval 0.63x1.865 smd: 1(-1.905,-2.683) 2(-0.635,-2.683) 3(0.635,-2.683) 4(1.905,-2.683) 5(1.905,2.683) 6(0.635,2.683) 7(-0.635,2.683) 8(-1.905,2.683)
SOT-23-3_L2.9-W1.3-P1.90-LS2.4-BR
  rect 1.25x0.7 smd: 1(1,-0.95) 2(1,0.95) 3(-1,0)
SOT-23_L2.9-W1.3-P1.90-LS2.4-BR
  rect 1x0.8 smd: 1(1.15,-0.95) 2(1.15,0.95) 3(-1.15,0)
SOT-223_L6.5-W3.5-P2.30-LS7.0-BR
  rect 2.465x1.05 smd: 1(2.857,-2.3) 2(2.857,0) 3(2.857,2.3)
  rect 2.465x3.54 smd: 4(-2.857,0)
SOT-323_L2.0-W1.3-P1.30-LS2.1-BR
  rect 0.9x0.8 smd: 1(0.8,-0.65) 2(0.8,0.65) 3(-0.8,0)
SW-SMD_TS24CA
  rect 0.9x1.2 smd: 1(-2.3,0.775) 2(2.3,0.775)
  rect 1.2x1.3 smd: 3(-1.675,-0.775) 4(1.675,-0.775)
WIRELM-SMD_ESP32-S
  rect 3x1 smd: 1(-9,9.005) 2(-9,7.735) 3(-9,6.465) 4(-9,5.195) 5(-9,3.925) 6(-9,2.655) 7(-9,1.385) 8(-9,0.115) 9(-9,-1.155) 10(-9,-2.425) 11(-9,-3.695) 12(-9,-4.965) 13(-9,-6.235) 14(-9,-7.505) 25(9,-7.505) 26(9,-6.235) 27(9,-4.965) 28(9,-3.695) 29(9,-2.425) 30(9,-1.155) 31(9,0.115) 32(9,1.385) 33(9,2.655) 34(9,3.925) 35(9,5.195) 36(9,6.465) 37(9,7.735) 38(9,9.005)
  rect 1x3 smd: 15(-5.715,-9.005) 16(-4.445,-9.005) 17(-3.175,-9.005) 18(-1.905,-9.005) 19(-0.635,-9.005) 20(0.635,-9.005) 21(1.905,-9.005) 22(3.175,-9.005) 23(4.445,-9.005) 24(5.715,-9.005)
  rect 3.6x3.6 smd: 39(-1.105,1.815)
下载调试点
  round 1 smd far side: 1(0,0.508) 2(0,-1.01) 3(0,-2.54)
电池焊接端子封装2
  custom 5.08x2.413 smd far side: 1(2.54,2.477)

## Nets
3V3: BUZZER1.1 C1.2 C2.2 C7.1 C11.1 C18.2 C21.2 C22.2 D5.1 L1.1 Q1.1 R1.2 R2.2 R6.1 SCREEN.15 SCREEN.16 TP.4 U1.2 U7.2 U7.4
GND: C1.1 C2.1 C3.1 C4.2 C5.2 C7.2 C8.2 C9.1 C10.1 C11.2 C12.2 C13.2 C14.1 C15.1 C16.1 C17.2 C18.1 C19.1 C20.1 C21.1 C22.1 D3.1 FPC1.2 FPC1.3 FPC1.4 Q3.2 R3.1 R7.2 R8.2 SCREEN.8 SCREEN.17 SCREEN.25 SCREEN.26 SW1.3 SW2.4 TP.1 TP.8 U1.1 U1.15 U1.38 U1.39 U2.3 U3.1 U3.3 U3.9 U5.1 U6.3 U7.1 USB.5 USB.6
VIN: C3.2 C19.2 C20.2 FPC1.1 U3.5 U4.1 U7.3
BEEP: R9.1 U1.23
BUSY: SCREEN.9 U1.16
CH_RXD: Q1.2 U6.7
CH_TXD: D1.1 U6.6
CS: SCREEN.12 U1.12
D+: U6.1 USB.3
D-: U6.2 USB.2
D/C: SCREEN.11 U1.13
GDR: Q2.1 R7.1 SCREEN.2
IO0: R2.1 SW2.3 U1.25
LED_GREEN: LED2.1 U3.6
LED_RED: LED1.1 U3.7
PREVGH: C8.1 D4.1 SCREEN.21
PREVGL: C16.2 D2.2 SCREEN.23
RES: SCREEN.10 U1.14
RESE: Q2.2 R8.1 SCREEN.3
RST: R1.1 SW1.4 U1.3
RXD: D1.2 R6.2 U1.34 U2.2
SCL: TP.5 U1.8
SCLK: SCREEN.13 U1.10
SDA: TP.6 U1.9
SDI: SCREEN.14 U1.11
T_INT: TP.2 U1.26
T_RST: TP.3 U1.29
TXD: Q1.3 U1.35 U2.1
VCOM: C17.1 SCREEN.24
VUSB: C5.1 R4.2 R5.2 U3.4 U3.8 U6.5 USB.1
$15N651: LED2.2 R5.1
$15N655: R3.2 U3.2
$15N663: LED1.2 R4.1
$15N3080: C4.1 U6.8
$15N5618: C9.2 SCREEN.4
$15N5619: C12.1 SCREEN.18
$15N5620: C13.1 SCREEN.19
$15N5621: C14.2 SCREEN.20
$15N5636: C10.2 SCREEN.5
$15N5638: C15.2 SCREEN.22
$15N5648: C6.1 D4.2 L1.2 Q2.3
$15N5649: C6.2 D2.1 D3.2
$15N5898: BUZZER1.2 D5.2 Q3.3
$15N5899: Q3.1 R9.2

Pads without a net: BUZZER1 3; SCREEN 1 6 7; SW1 1 2; SW2 1 2; TP 7; U1 4 5 6 7 17 18 19 20 21 22 24 27 28 30 31 32 33 36 37; U6 4; USB 4

## Via types
v1: diameter 0.61, hole 0.305, Top Layer to Bottom Layer, 63 vias

## Routing (per net, layer and track width the routed paths; a pad name or vN(x,y) marks a point on that pad's centre or on a via; arc(x,y) is an arc through that point)
3V3: length 143.7
  Top Layer w0.254: 31.96,13.46 32.01,13.51 32.01,13.34 ; 4.83,15.87 4.83,14.86 4.32,14.35 v1(4.32,9.91)
  Top Layer w0.381: 29.21,29.97 v1(28.19,28.96) ; U7.4 28.58,32.62 C22.2 26.8,34.67 ; C18.2 22.28,35.06 D5.1 ; L1.1 23.11,21.46 v1(21.34,19.69) ; Q1.1 14.29,24.7 14.61,24.38 14.61,23.88 R6.1 15.49,21.08 16.38,20.19 ; R2.2 32,8.51 32.01,8.51 32.01,13.34 31.37,13.97 30.48,13.97 29.46,14.99 29.46,23.23 29.85,23.62 ; SCREEN.16 20.06,13.6 19.94,13.72 v1(19.56,13.72) 19.56,12.66 ; C11.1 15.24,5.21 19.56,9.53 19.56,9.53 SCREEN.15 ; R1.2 32,15.61 32,13.52 32.01,13.51
  Top Layer w0.508: 9.27,12.32 8.13,11.18 5.59,11.18 v1(4.32,9.91) ; 9.27,12.32 10.67,13.72 C7.1 ; 9.27,12.32 9.27,18.16 10.23,19.12 11.37,19.12 12.45,20.19 17.79,20.19 18.92,21.33 18.92,25.4 19.91,26.39 21.94,26.39 22.86,27.31 22.86,28.5 23.57,29.21 24.75,29.21 U7.2 ; D5.1 22.61,33.66 23.5,32.77 23.5,31.24 24.77,29.97 U7.2 ; U7.2 U7.4 31.24,29.97 31.62,29.59 31.62,24.51 30.73,23.62 26.29,23.62 25.21,22.54 L1.1
  Bottom Layer w0.381: v1(21.34,19.69) 21.34,17.91 19.56,16.13 v1(19.56,13.72) ; C1.2 2.31,8.42 C2.2 ; BUZZER1.1 26.97,28.96 v1(28.19,28.96)
  Bottom Layer w0.508: 7.26,9.03 5.19,9.03 v1(4.32,9.91) 4.32,8.58 C1.2
GND: length 62.1
  Top Layer w0.254: 20.56,12.53 20.57,12.54 20.57,13.97 20.19,14.35 17.02,14.35 16.06,13.39 16.06,12.53 ; v1(29.34,7.37) 28.7,6.73 v1(28.7,6.35) 28.7,4.7 30.48,2.92 30.48,2.91 SW2.4 29.19,2.9 28.98,2.69 C16.1 C15.1 C14.1 C10.1 C9.1 10.77,2.69 10.16,3.3 10.16,9.66 10.6,10.1 ; v1(11.18,30.82) 13.99,30.82 U3.9 ; R7.2 12.59,18.18 v1(13.72,19.3) ; v1(14.61,18.29) 14.61,17.26 R8.2 ; v1(9.14,25.91) 9.14,27.37 C4.2 ; 3.3,16 2.41,16
  Bottom Layer w0.254: FPC1.2 6.61,31.88 10.12,31.88 v1(11.18,30.82) 12.23,30.82 U5.1 ; v1(13.72,19.3) 14.61,18.42 v1(14.61,18.29) ; 10.29,25.77 10.15,25.91 v1(9.14,25.91)
  vias: v1(0.76,10.41) v1(0.76,9.4) v1(0.89,21.72) v1(1.78,10.41) v1(1.78,9.4) v1(1.91,21.72) v1(2.79,10.41) v1(2.79,9.4) v1(4.19,36.32) v1(4.19,35.31) v1(4.95,13.34) v1(4.95,12.19) v1(5.21,36.32) v1(5.21,35.31) v1(6.22,36.32) v1(6.22,35.31) v1(9.06,7.02) v1(17.18,17.72) v1(20.32,11.3) v1(20.32,10.41) v1(21.21,14.1) v1(27.81,30.99) v1(27.81,27.69) v1(28.96,30.99) v1(28.96,27.69) v1(30.61,20.83) v1(32,34.67) v1(32,33.66)
VIN: length 32.1
  Top Layer w0.508: 16.26,33.25 16.41,33.4 v1(16.89,33.4) 17.65,33.4 18.1,32.96 C3.2 ; C20.2 C19.2 26.54,26.62 v1(26.44,26.73) 25.51,27.66 25.51,27.67
  Bottom Layer w0.508: 16.94,32.77 U4.1 12.95,33.27 6.74,33.27 FPC1.1 ; 16.94,32.77 22.86,32.77 24.13,31.5 24.13,28.58 25.97,26.73 v1(26.44,26.73) ; 16.94,32.77 16.94,33.36 v1(16.89,33.4)
BEEP: length 4.3
  Top Layer w0.254: v1(19.3,27.81) 20,27.81 20.13,27.94 R9.1
  Bottom Layer w0.254: v1(19.3,27.81) 20.32,27.81 20.65,27.48 20.65,25.84
BUSY: length 19.4
  Top Layer w0.254: v1(15.62,11.18) 16,11.18 16.56,11.73 SCREEN.9
  Bottom Layer w0.254: 11.81,25.77 11.81,22.23 12.95,21.08 12.95,11.81 13.59,11.18 v1(15.62,11.18)
CH_RXD: length 2
  Top Layer w0.254: Q1.2 11.39,22.99 9.68,22.99
CH_TXD: length 8
  Top Layer w0.254: D1.1 17.57,21.72 v1(16.42,21.72) ; 9.68,21.72 v1(14.43,21.72)
  Bottom Layer w0.254: v1(16.42,21.72) v1(14.43,21.72)
CS: length 24.8
  Top Layer w0.254: SCREEN.12 18.06,10.82 v1(15.62,8.38)
  Bottom Layer w0.254: 7.26,21.73 9.39,21.73 11.05,20.07 11.05,10.41 13.08,8.38 v1(15.62,8.38)
D+: length 8.3
  Top Layer w0.254: U6.1 5.46,24.26 5.74,24.53 5.74,27.58 6.1,27.94 6.1,29.72 5.72,30.1 USB.3
D-: length 10.9
  Top Layer w0.254: U6.2 5.72,22.99 6.22,23.5 6.22,27.31 6.6,27.69 6.6,29.97 5.83,30.75 USB.2
D/C: length 23.8
  Top Layer w0.254: SCREEN.11 17.56,11.21 v1(15.62,9.27)
  Bottom Layer w0.254: 7.26,23 9.13,23 11.68,20.45 11.68,10.92 13.34,9.27 v1(15.62,9.27)
GDR: length 15.7
  Top Layer w0.254: 12.57,15.49 12.57,14.48 13.06,14 SCREEN.2 ; R7.1 13.22,15.5 13.46,15.75 13.46,18.16 14.86,19.56 18.54,19.56 19.92,20.94 19.92,22.57
IO0: length 22.1
  Top Layer w0.254: SW2.3 30.44,6.28 30.44,8.46 R2.1 29.34,8.51 28.45,9.4 v1(28.45,22.48)
  Bottom Layer w0.254: 25.27,24.26 27.43,24.26 28.45,23.24 v1(28.45,22.48)
LED_GREEN: length 7.9
  Top Layer w0.254: 14.99,33.25 14.99,34.16 15.37,34.54 v1(15.75,34.54)
  Bottom Layer w0.254: LED2.1 20.61,35.67 20.62,35.67 20.62,34.85 20.31,34.54 v1(15.75,34.54)
LED_RED: length 2.7
  Top Layer w0.254: v1(13.72,34.8) 13.72,33.25
  Bottom Layer w0.254: v1(13.72,34.8) 14.01,35.09 LED1.1
PREVGH: length 8.6
  Top Layer w0.254: SCREEN.21 22.56,13.7 20.81,15.45 D4.1 20.02,15.45 19.43,14.86 17.02,14.86 C8.1
PREVGL: length 12.8
  Top Layer w0.254: C16.2 25.39,4.1 25.39,6.11 23.56,7.94 SCREEN.23 23.56,13.78 25.15,15.37 D2.2
RES: length 22.8
  Top Layer w0.254: SCREEN.10 17.06,11.59 v1(15.62,10.16)
  Bottom Layer w0.254: 7.26,24.27 8.81,24.27 12.32,20.76 12.32,11.43 13.59,10.16 v1(15.62,10.16)
RESE: length 15.2
  Top Layer w0.254: SCREEN.3 13.56,14.71 R8.1 14.87,15.5 15.24,15.88 15.24,18.42 15.88,19.05 18.92,19.05 20.45,20.57 20.45,21.21 21.22,21.99 21.22,22.57
RST: length 38.8
  Top Layer w0.254: SW1.4 30.49,19.13 R1.1 30.49,15.49 v1(31.24,14.73)
  Bottom Layer w0.254: U1.3 9,10.3 9.29,10.01 9.29,9 12.06,6.22 26.54,6.22 27.81,7.49 27.81,8.76 28.58,9.53 31.5,9.53 31.88,9.91 31.88,14.1 v1(31.24,14.73)
RXD: length 26.2
  Top Layer w0.254: v1(17.65,23.24) D1.2 16.97,24.5 R6.2
  Bottom Layer w0.254: 25.27,12.84 29.95,12.84 U2.2 ; 25.27,12.84 23.5,12.83 22.61,13.72 22.61,21.59 20.96,23.24 v1(17.65,23.24) ; 25.27,12.84 25.26,12.84
SCL: length 6.5
  Top Layer w0.254: TP.5 5.33,15.98 5.33,14.48 v1(4.95,14.1)
  Bottom Layer w0.254: v1(4.95,14.1) 4.95,15.88 5.73,16.65 7.26,16.65
SCLK: length 25.4
  Top Layer w0.254: v1(14.99,6.86) 18.56,10.43 SCREEN.13
  Bottom Layer w0.254: 7.26,19.19 9.26,19.19 9.8,18.64 9.8,9.63 12.32,7.11 14.73,7.11 v1(14.99,6.86)
SDA: length 5
  Top Layer w0.254: 5.84,15.59 5.84,15.97 TP.6 5.82,16.68 4.95,17.55 v1(4.95,17.91)
  Bottom Layer w0.254: 7.26,17.92 7.24,17.91 v1(4.95,17.91)
SDI: length 26.9
  Top Layer w0.254: v1(16,6.98) 19.06,10.04 SCREEN.14
  Bottom Layer w0.254: v1(16,6.98) 15.24,7.75 12.7,7.75 10.41,10.03 10.41,19.69 9.64,20.46 7.26,20.46
T_INT: length 37.5
  Top Layer w0.254: v1(3.68,19.43) 3.81,19.3 3.81,15.63
  Bottom Layer w0.254: 25.26,23 23.88,23 23.62,23.25 23.62,27.69 22.48,28.83 17.15,28.83 16.38,28.07 7,28.07 3.68,24.75 v1(3.68,19.43)
T_RST: length 39.6
  Top Layer w0.254: v1(4.44,19.05) 4.32,18.93 4.32,15.74
  Bottom Layer w0.254: v1(4.44,19.05) 4.44,24.64 7.37,27.56 16.68,27.56 ; 16.65,27.57 17.4,28.32 18.35,28.32 18.45,28.42 20.16,28.42 20.26,28.32 22.22,28.32 23.11,27.43 23.11,19.81 23.74,19.19 25.26,19.19
TXD: length 27.9
  Top Layer w0.254: v1(13.97,22.61) 13.97,23.48 13.7,23.75 Q1.3
  Bottom Layer w0.254: 25.26,11.57 25.27,11.57 ; 25.27,11.57 22.99,11.56 22.1,12.45 22.1,21.34 20.78,22.66 14.02,22.66 v1(13.97,22.61) ; 25.27,11.57 29.71,11.57 U2.1
VCOM: length 10
  Top Layer w0.254: SCREEN.24 24.06,8.08 27.41,4.72 27.41,4.09 C17.1
VUSB: length 38
  Top Layer w0.381: 7.24,27.56 6.73,27.05 6.73,21.97 8.25,20.45 9.68,20.45 ; 7.24,27.56 7.81,26.99 C5.1 ; 7.24,27.56 7.24,31.24 7.08,31.4 ; 7.08,31.4 USB.1 ; 7.08,31.4 10.08,31.4 11.44,32.77 11.97,32.77 12.45,33.25 12.45,34.42 12.57,34.54 R4.2 R5.2 ; 10.93,32.13 16.13,32.13 16.51,31.75 16.51,29.08 16.26,28.83 U3.4
$15N651: length 2.7
  Top Layer w0.254: v1(17.91,35.69) R5.1
  Bottom Layer w0.254: v1(17.91,35.69) 18.75,35.69 LED2.2 19.01,35.69 19.01,35.69
$15N655: length 5.6
  Top Layer w0.254: 13.72,27.43 13.72,26.82 13.97,26.57 17.01,26.57 18.14,27.69 R3.2
$15N663: length 3
  Top Layer w0.254: v1(11.05,34.54) 11.07,34.56 R4.1
  Bottom Layer w0.254: v1(11.05,34.54) 12.32,35.82 LED1.2
$15N3080: length 2.9
  Top Layer w0.381: C4.1 10.16,24.73 9.68,24.26
$15N5618: length 9.8
  Top Layer w0.254: C9.2 11.18,4.83 14.06,7.71 SCREEN.4
$15N5619: length 10
  Top Layer w0.254: 17.27,4.18 17.27,6.35 21.06,10.13 SCREEN.18
$15N5620: length 9.5
  Top Layer w0.254: SCREEN.19 21.56,10 19.3,7.75 C13.1
$15N5621: length 8.9
  Top Layer w0.254: SCREEN.20 22.06,9.74 21.34,9.02 C14.2
$15N5636: length 9.1
  Top Layer w0.254: SCREEN.5 14.56,7.44 13.21,6.1 C10.2
$15N5638: length 8.7
  Top Layer w0.254: SCREEN.22 23.06,7.81 23.38,7.48 23.38,4.12 23.36,4.11
$15N5648: length 12
  Top Layer w0.254: 20.57,24.17 20.6,24.2 23.02,24.2 ; C6.1 18.16,17.02 18.53,17.02 20.32,18.81 D4.2 20.32,19.56 20.96,20.19 20.96,20.87 21.97,21.89 21.97,23.15 23.02,24.2 ; 23.11,24.2 23.02,24.2
$15N5649: length 8.7
  Top Layer w0.254: 22.73,18.84 25.07,18.84 25.15,18.92 ; C6.2 18.16,15.62 18.8,15.62 20.19,17.02 21.34,17.02 22.73,18.41 22.73,18.84 22.69,18.84
$15N5898: length 6
  Top Layer w0.254: v1(19.81,29.46) 19.81,29.47 19.81,30.6 19.93,30.73 Q3.3 D5.2
  Bottom Layer w0.254: v1(19.81,29.46) 20.79,29.46 BUZZER1.2
$15N5899: length 2
  Top Layer w0.254: Q3.1 22.23,28.28 21.89,27.94

## Copper pours and planes (outline as drawn; the poured copper is in the pictures)
GND on Top Layer: -0.13,37.08 33.15,37.08 33.15,6.6 -0.13,6.6
GND on Bottom Layer: -0.13,37.08 33.15,37.08 33.15,6.1 -0.13,6.1

Small or netless copper shapes (teardrops, artwork), in the pictures only: 19 on Top Layer, 3 on Bottom Layer

## Text on the board
Bottom Silkscreen Layer: G / R / T
